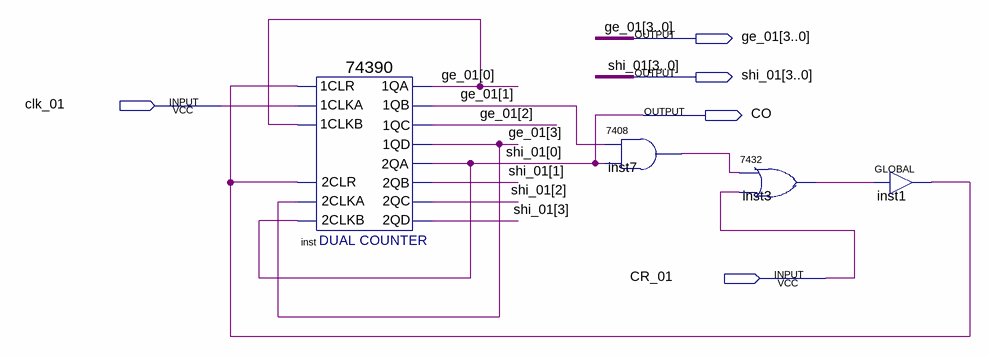
[diagram p0: schematic sheet]
// Quartus schematic cnt12.bdf as structural Verilog: 4 symbols, 5 pins
module cnt12 (
  input  clk_01,
  input  CR_01,
  output [3:0] ge_01,
  output [3:0] shi_01,
  output CO
);

  wire inst1_out, inst3_1, inst7_1;

  \74390  inst (
    .\2CLKA (ge_01[3]), .\2CLR (inst1_out), .\2CLKB (CO), .\1CLR (inst1_out), .\1CLKA (clk_01),
    .\1CLKB (ge_01[0]), .\1QA (ge_01[0]), .\1QB (ge_01[1]), .\1QC (ge_01[2]), .\1QD (ge_01[3]), .\2QA (CO),
    .\2QB (shi_01[1]), .\2QC (shi_01[2]), .\2QD (shi_01[3]));
  \7408  inst7 (.\3 (CO), .\2 (ge_01[1]), .\1 (inst7_1));
  \7432  inst3 (.\2 (inst7_1), .\3 (CR_01), .\1 (inst3_1));
  GLOBAL inst1 (.IN(inst3_1), .OUT(inst1_out));

  assign shi_01[0] = CO;
endmodule
